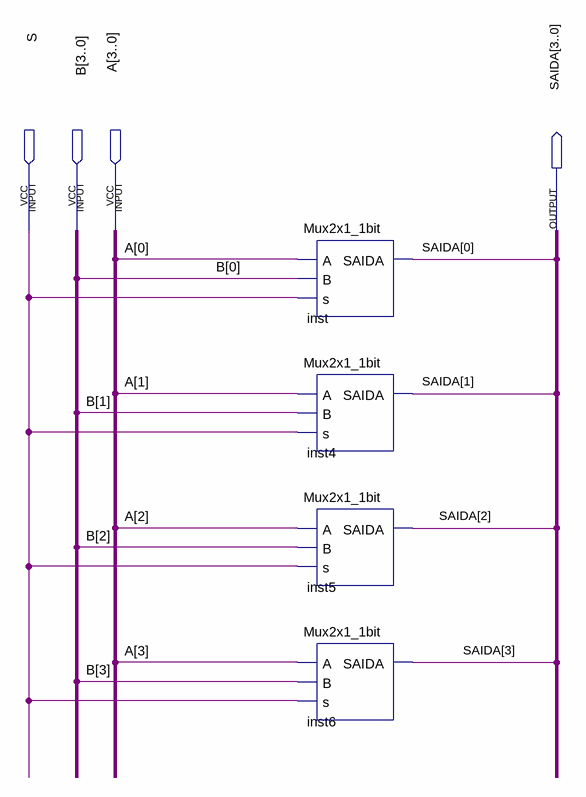
[diagram p0: schematic sheet]
// Quartus schematic Mux2x1_4bits.bdf as structural Verilog: 4 symbols, 4 pins
module Mux2x1_4bits (
  input  S,
  input  [3:0] B,
  input  [3:0] A,
  output [3:0] SAIDA
);

  Mux2x1_1bit inst (.A(A[0]), .B(B[0]), .s(S), .SAIDA(SAIDA[0]));
  Mux2x1_1bit inst4 (.A(A[1]), .B(B[1]), .s(S), .SAIDA(SAIDA[1]));
  Mux2x1_1bit inst5 (.A(A[2]), .B(B[2]), .s(S), .SAIDA(SAIDA[2]));
  Mux2x1_1bit inst6 (.A(A[3]), .B(B[3]), .s(S), .SAIDA(SAIDA[3]));
endmodule
